# EAGLE schematic XmegaA4U_v2.1 (EAGLE 6.3)
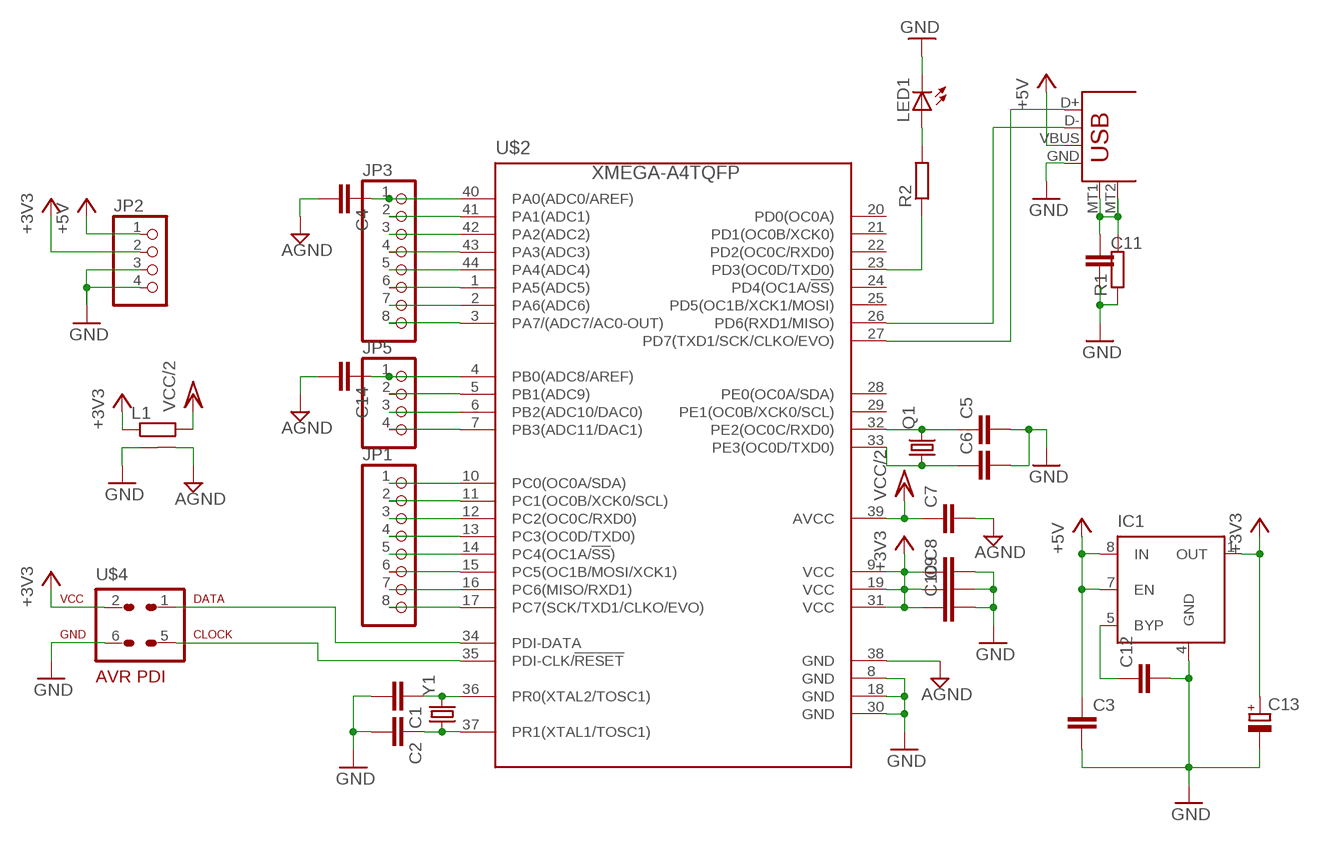
[diagram p0: schematic, sheet 1]

## Parts
C1  C-EUC0603  [C0603]
C2  C-EUC0603  [C0603]
C3  C-EUC0805  [C0805]
C4  C-EUC0402  [C0402]
C5  C-EUC0402  [C0402]
C6  C-EUC0402  [C0402]
C7  C-EUC0603  [C0603]
C8  C-EUC0603  [C0603]
C9  C-EUC0603  [C0603]
C10  C-EUC0603  [C0603]
C11  C-EUC0603  [C0603]
C12  C-EUC0603  [C0603]
C13  CPOL-EUSMCA  [SMC_A]
C14  C-EUC0402  [C0402]
IC1  TC1269  [MSOP08]
JP1  PINHD_FIXEDPAD_ROUND-1X8  [1X08_ROUND]
JP2  PINHD_FIXEDPAD_ROUND-1X4  [1X04_ROUND]
JP3  PINHD_FIXEDPAD_ROUND-1X8  [1X08_ROUND]
JP5  PINHD_FIXEDPAD_ROUND-1X4  [1X04_ROUND]
L1  R-EU_R0603  [R0603]
LED1  LEDCHIP-LED0603  [CHIP-LED0603]
Q1  CRYSTALTC26V_1.00  [TC26V_1.00]
R1  R-EU_R0603  [R0603]
R2  R-EU_R0603  [R0603]
U$1  LINE1.27X0.254MM  [LINE-1.27X0.254MM]
U$2  XMEGA-A4TQFP  [TQFP44]
U$4  AVR-PDIFIXED  [2X03_FIXED]
U$5  USB+SHIELDMICRO  [USB-MICROB]
Y1  CRYSTAL5X3  [CRYSTAL-SMD-5X3]

## Nets
+3V3: C8.1 C9.1 C10.1 C13.+ IC1.1(OUT) JP2.2 L1.1 U$2.9(VCC) U$2.19(VCC) U$2.31(VCC) U$4.2(2_VCC)
+5V: C3.1 IC1.7(EN) IC1.8(IN) JP2.1 U$5.VBUS
AGND: C4.2 C7.2 C14.2 U$1.P$2 U$2.38(GND)
GND: C1.2 C2.2 C3.2 C5.2 C6.2 C8.2 C9.2 C10.2 C11.2 C12.2 C13.- IC1.4(GND) JP2.3 JP2.4 LED1.C R1.1 U$1.P$1 U$2.8(GND) U$2.18(GND) U$2.30(GND) U$4.6(6_GND) U$5.GND
MNT: C11.1 R1.2 U$5.MT1 U$5.MT2
N$1: C1.1 U$2.36(PR0(XTAL2/TOSC1)) Y1.3
N$2: C2.1 U$2.37(PR1(XTAL1/TOSC1)) Y1.1
N$4: R2.1 U$2.23(PD3(OC0D/TXD0))
N$5: LED1.A R2.2
N$10: U$2.26(PD6(RXD1/MISO)) U$5.D-
N$11: U$2.27(PD7(TXD1/SCK/CLKO/EVO)) U$5.D+
N$17: JP3.2 U$2.41(PA1(ADC1))
N$18: JP3.3 U$2.42(PA2(ADC2))
N$19: JP3.4 U$2.43(PA3(ADC3))
N$20: JP3.5 U$2.44(PA4(ADC4))
N$21: JP3.6 U$2.1(PA5(ADC5))
N$22: JP3.7 U$2.2(PA6(ADC6))
N$25: JP1.2 U$2.11(PC1(OC0B/XCK0/SCL))
N$26: JP1.3 U$2.12(PC2(OC0C/RXD0))
N$27: JP1.4 U$2.13(PC3(OC0D/TXD0))
N$28: JP1.5 U$2.14(PC4(OC1A/!SS!))
N$29: JP1.6 U$2.15(PC5(OC1B/MOSI/XCK1))
N$30: JP1.7 U$2.16(PC6(MISO/RXD1))
N$33: JP5.2 U$2.5(PB1(ADC9))
N$34: JP5.3 U$2.6(PB2(ADC10/DAC0))
N$36: U$2.35(PDI-CLK/!RESET) U$4.5(5_CLOCK)
N$40: C12.1 IC1.5(BYP)
N$42: U$2.34(PDI-DATA) U$4.1(1_DATA)
VCC/2: C7.1 L1.2 U$2.39(AVCC)
XA0: C4.1 JP3.1 U$2.40(PA0(ADC0/AREF))
XA7: JP3.8 U$2.3(PA7/(ADC7/AC0-OUT))
XB0: C14.1 JP5.1 U$2.4(PB0(ADC8/AREF))
XB3: JP5.4 U$2.7(PB3(ADC11/DAC1))
XC0: JP1.1 U$2.10(PC0(OC0A/SDA))
XC7: JP1.8 U$2.17(PC7(SCK/TXD1/CLKO/EVO))
XE2: C5.1 Q1.2 U$2.32(PE2(OC0C/RXD0))
XE3: C6.1 Q1.1 U$2.33(PE3(OC0D/TXD0))
Unconnected: U$2.20(PD0(OC0A)) U$2.21(PD1(OC0B/XCK0)) U$2.22(PD2(OC0C/RXD0)) U$2.24(PD4(OC1A/!SS!)) U$2.25(PD5(OC1B/XCK1/MOSI)) U$2.28(PE0(OC0A/SDA)) U$2.29(PE1(OC0B/XCK0/SCL))

## Library data of the parts
C1-C12 C14 = rcl:C-EU: CAPACITOR, European symbol
C13 = rcl:CPOL-EU: POLARIZED CAPACITOR, European symbol
IC1 = hsa:TC1269: Connecting a 470pF to the BYP input further reduces output noise. The regulator is enabled when a logic high (input voltage x 0.45) is applied to the EN input. Max input voltage 6.0V, max output current 300mA.
JP1 JP3 = hsa:PINHD_FIXEDPAD_ROUND-1X8: PIN HEADER
JP2 JP5 = hsa:PINHD_FIXEDPAD_ROUND-1X4: PIN HEADER
L1 R1 R2 = rcl:R-EU_: RESISTOR, European symbol
LED1 = led:LED: LED OSRAM: - CHIPLED LG R971, LG N971, LY N971, LG Q971, LY Q971, LO R971, LY R971 LH N974, LH R974 LS Q976, LO Q976, LY Q976 LO Q996 - Hyper CHIPLED LW Q18S LB Q993, LB Q99A, LB R99A - SideLED LS A670, LO A670, LY A670, LG A670, LP A670 LB A673, LV A673, LT A673, LW A673 LH A674 LY A675 LS A676, LA A676, LO A676, LY A676, LW A676 LS A679, LY A679, LG A679 - Hyper Micro SIDELED® LS Y876, LA Y876, LO Y876, LY Y876 LT Y87S - SmartLED LW L88C, LW L88S LB L89C, LB L89S, LG L890 LS L89K, LO L89K, LY L89K LS L896, LA L896, LO L896, LY L896 - TOPLED LS T670, LO T670, LY T670, LG T670, LP T670 LSG T670, LSP T670, LSY T670, LOP T670, LYG T670 LG T671, LOG T671, LSG T671 LB T673, LV T673, LT T673, LW T673 LH T674 LS T676, LA T676, LO T676, LY T676, LB T676, LH T676, LSB T676, LW T676 LB T67C, LV T67C, LT T67C, LS T67K, LO T67K, LY T67K, LW E67C LS E67B, LA E67B, LO E67B, LY E67B, LB E67C, LV E67C, LT E67C LW T67C LS T679, LY T679, LG T679 LS T770, LO T770, LY T770, LG T770, LP T770 LB T773, LV T773, LT T773, LW T773 LH T774 LS E675, LA E675, LY E675, LS T675 LS T776, LA T776, LO T776, LY T776, LB T776 LHGB T686 LT T68C, LB T68C - Hyper Mini TOPLED® LB M676 - Mini TOPLED Santana® LG M470 LS M47K, LO M47K, LY M47K Source: http://www.osram.convergy.de LUXEON: - LUMILED® LXK2-PW12-R00, LXK2-PW12-S00, LXK2-PW14-U00, LXK2-PW14-V00 LXK2-PM12-R00, LXK2-PM12-S00, LXK2-PM14-U00 LXK2-PE12-Q00, LXK2-PE12-R00, LXK2-PE12-S00, LXK2-PE14-T00, LXK2-PE14-U00 LXK2-PB12-K00, LXK2-PB12-L00, LXK2-PB12-M00, LXK2-PB14-N00, LXK2-PB14-P00, LXK2-PB14-Q00 LXK2-PR12-L00, LXK2-PR12-M00, LXK2-PR14-Q00, LXK2-PR14-R00 LXK2-PD12-Q00, LXK2-PD12-R00, LXK2-PD12-S00 LXK2-PH12-R00, LXK2-PH12-S00 LXK2-PL12-P00, LXK2-PL12-Q00, LXK2-PL12-R00 Source: www.luxeon.com KINGBRIGHT: KA-3528ASYC Source: www.kingbright.com
Q1 = hsa:CRYSTAL: CRYSTAL
U$1 = sekalaista:LINE
U$2 = avr-7:XMEGA-A4: Atmel XMega A4 series processor
U$4 = hsa:AVR-PDI: AVR PDI programming interface connector
U$5 = hsa:USB+SHIELD: USB+Shield USB connector with shield pins connectable
Y1 = SparkFun:CRYSTAL: Crystals Various standard crystals. Proven footprints. Spark Fun Electronics SKU : COM-00534